# EAGLE design pedometer (EAGLE 9.6.2)
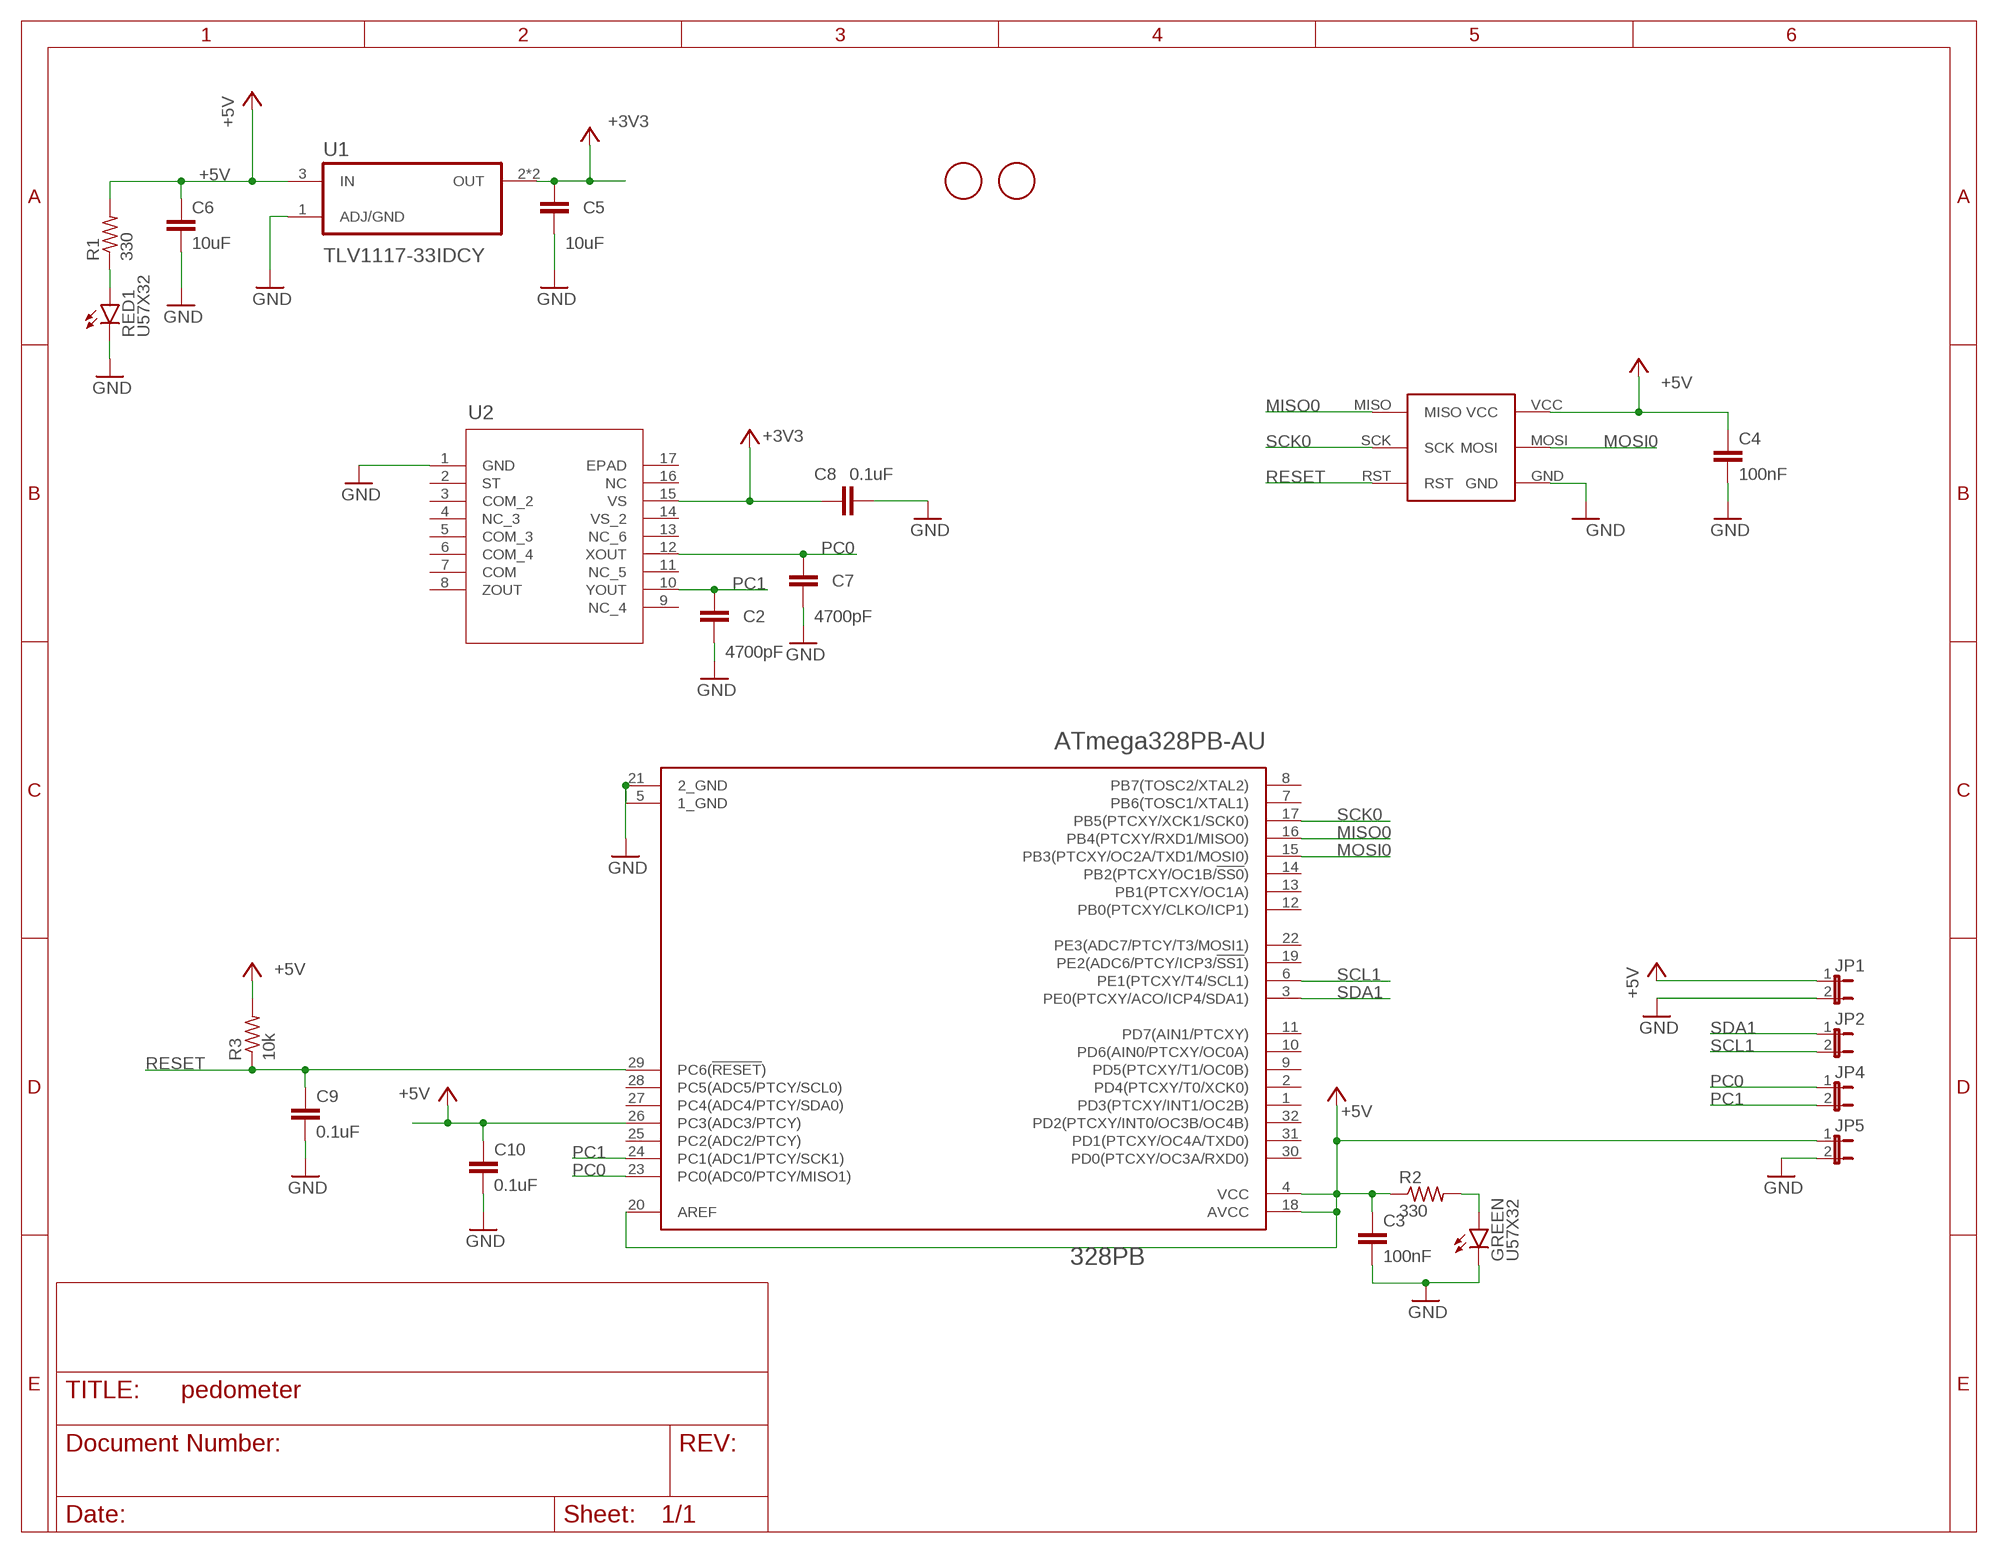
[diagram p0: schematic, sheet 1]

## Parts
328PB  MICROCHIP_ATMEGA328PB-AUMICROCHIP_ATMEGA328PB-AU_0_0  [MICROCHIP_ATMEGA328PB-AU_0]
C2  4700pF  C-EUC0805K  [C0805K]
C3  100nF  C-EUC0805K  [C0805K]
C4  100nF  C-EUC0805K  [C0805K]
C5  10uF  C-EUC0805K  [C0805K]
C6  10uF  C-EUC0805K  [C0805K]
C7  4700pF  C-EUC0805K  [C0805K]
C8  0.1uF  C-EUC0805K  [C0805K]
C9  0.1uF  C-EUC0805K  [C0805K]
C10  0.1uF  C-EUC0805K  [C0805K]
GREEN  U57X32  [U57X32]
JP1  JP1E  [JP1]
JP2  JP1E  [JP1]
JP4  JP1E  [JP1]
JP5  JP1E  [JP1]
R1  330  R-US_R0805  [R0805]
R2  330  R-US_R0805  [R0805]
R3  10k  R-US_R0805  [R0805]
RED1  U57X32  [U57X32]
U1  TLV1117-33IDCY  [SOT230P700X180-4N]
U2  ADXL327BCPZ-RL7CP_16_5A_ADI-M  [CP_16_5A_ADI-M]
U$1  AVR-ISP  [AVR-ISP]
U$2  FIDUCIAL  [FIDUCIAL_1MM]
U$3  FIDUCIAL  [FIDUCIAL_1MM]

## Nets
+3V3: C5.2 C8.2 U1.2(OUT) U1.4(OUT) U2.15(VS)
+5V: 328PB.4(VCC) 328PB.18(AVCC) 328PB.20(AREF) 328PB.26(PC3(ADC3/PTCY)) C3.2 C4.2 C6.2 C10.2 JP1.1 JP5.1 R1.2 R2.1 R3.2 U1.3(IN) U$1.VCC
GND: 328PB.5(1_GND) 328PB.21(2_GND) C2.1 C3.1 C4.1 C5.1 C6.1 C7.1 C8.1 C9.1 C10.1 GREEN.K(C) JP1.2 JP5.2 RED1.K(C) U1.1(ADJ/GND) U2.1(GND) U$1.GND
MISO0: 328PB.16(PB4(PTCXY/RXD1/MISO0)) U$1.MISO
MOSI0: 328PB.15(PB3(PTCXY/OC2A/TXD1/MOSI0)) U$1.MOSI
N$2: GREEN.A R2.2
N$6: R1.1 RED1.A
PC0: 328PB.23(PC0(ADC0/PTCY/MISO1)) C7.2 JP4.1 U2.12(XOUT)
PC1: 328PB.24(PC1(ADC1/PTCY/SCK1)) C2.2 JP4.2 U2.10(YOUT)
RESET: 328PB.29(PC6(!RESET!)) C9.2 R3.1 U$1.RST
SCK0: 328PB.17(PB5(PTCXY/XCK1/SCK0)) U$1.SCK
SCL1: 328PB.6(PE1(PTCXY/T4/SCL1)) JP2.2
SDA1: 328PB.3(PE0(PTCXY/ACO/ICP4/SDA1)) JP2.1
Unconnected: 328PB.1(PD3(PTCXY/INT1/OC2B)) 328PB.2(PD4(PTCXY/T0/XCK0)) 328PB.7(PB6(TOSC1/XTAL1)) 328PB.8(PB7(TOSC2/XTAL2)) 328PB.9(PD5(PTCXY/T1/OC0B)) 328PB.10(PD6(AIN0/PTCXY/OC0A)) 328PB.11(PD7(AIN1/PTCXY)) 328PB.12(PB0(PTCXY/CLKO/ICP1)) 328PB.13(PB1(PTCXY/OC1A)) 328PB.14(PB2(PTCXY/OC1B/!SS0!)) 328PB.19(PE2(ADC6/PTCY/ICP3/!SS1!)) 328PB.22(PE3(ADC7/PTCY/T3/MOSI1)) 328PB.25(PC2(ADC2/PTCY)) 328PB.27(PC4(ADC4/PTCY/SDA0)) 328PB.28(PC5(ADC5/PTCY/SCL0)) 328PB.30(PD0(PTCXY/OC3A/RXD0)) 328PB.31(PD1(PTCXY/OC4A/TXD0)) 328PB.32(PD2(PTCXY/INT0/OC3B/OC4B)) U2.2(ST) U2.3(COM_2) U2.4(NC_3) U2.5(COM_3) U2.6(COM_4) U2.7(COM) U2.8(ZOUT) U2.9(NC_4) U2.11(NC_5) U2.13(NC_6) U2.14(VS_2) U2.16(NC) U2.17(EPAD)

## Library data of the parts
328PB = Microchip - ATmega328PB-AU:MICROCHIP_ATMEGA328PB-AU: ATmega328PB Summary Datasheet; CENTROID_NOT_SPECIFIED: No; DATASHEET: http://ww1.microchip.com/downloads/en/DeviceDoc/40001907A.pdf; DIGIKEY_DESCRIPTION: IC MCU 8BIT 32KB FLASH 32TQFP; DIGIKEY_PART_NUMBER: ATMEGA328PB-AU-ND; LEAD_FREE: yes; MF: Microchip; MFG_PACKAGE_IDENT: 32A; MOUSER_PART_NUMBER: 556-ATMEGA328PB-AU; MPN: ATmega328PB-AU; PACKAGE: TQFP32; PREFIX: U; ROHS: yes; TEMPERATURE_RANGE_HIGH: +85°C; TEMPERATURE_RANGE_LOW: -40°C; VOLTAGE: 5.5V
C2-C10 = rcl:C-EU: CAPACITOR, European symbol; SPICEPREFIX: C
GREEN RED1 = led:U57X32: LED rectangle, 5.7 x 3.2 mm
JP1 JP2 JP4 JP5 = jumper:JP1E: JUMPER
R1-R3 = rcl:R-US_: RESISTOR, American symbol; SPICEPREFIX: R
U1 = TLV1117-33IDCY:TLV1117-33IDCY: Check prices <https://pricing.snapeda.com/parts/TLV1117-33IDCY/Texas%20Instruments/view-part?ref=eda>; AVAILABILITY: Good; DESCRIPTION: 800-mA, 15-V, linear voltage regulator 4-SOT-223 -40 to 125; MF: Texas Instruments; MP: TLV1117-33IDCY; PACKAGE: SOT-223-4 Texas Instruments; PRICE: None; PURCHASE-URL: https://pricing.snapeda.com/search/part/TLV1117-33IDCY/?ref=eda
U2 = adxl327:ADXL327BCPZ-RL7; BUILT_BY: EMA_UL_Team; COPYRIGHT: Copyright (C) 2018 Accelerated Designs. All rights reserved; MANUFACTURER_PART_NUMBER: ADXL327BCPZ-RL7; SOURCELIBRARY: Analog_2019-03-08; VENDOR: Analog Devices Inc
U$1 = AVR-ISP:AVR-ISP: Check prices <https://pricing.snapeda.com/parts/AVR-ISP/Gravitech/view-part?ref=eda>; AVAILABILITY: Bad; DESCRIPTION: Emulators / Simulators AVR USB IN CIRCUIT EMUL/PRGMR ISP; MF: Gravitech; MP: AVR-ISP; PACKAGE: None; PRICE: None
U$2 U$3 = adafruit:FIDUCIAL: For use by pick and place machines to calibrate the vision/machine, 1mm By microbuilder.eu

## Board
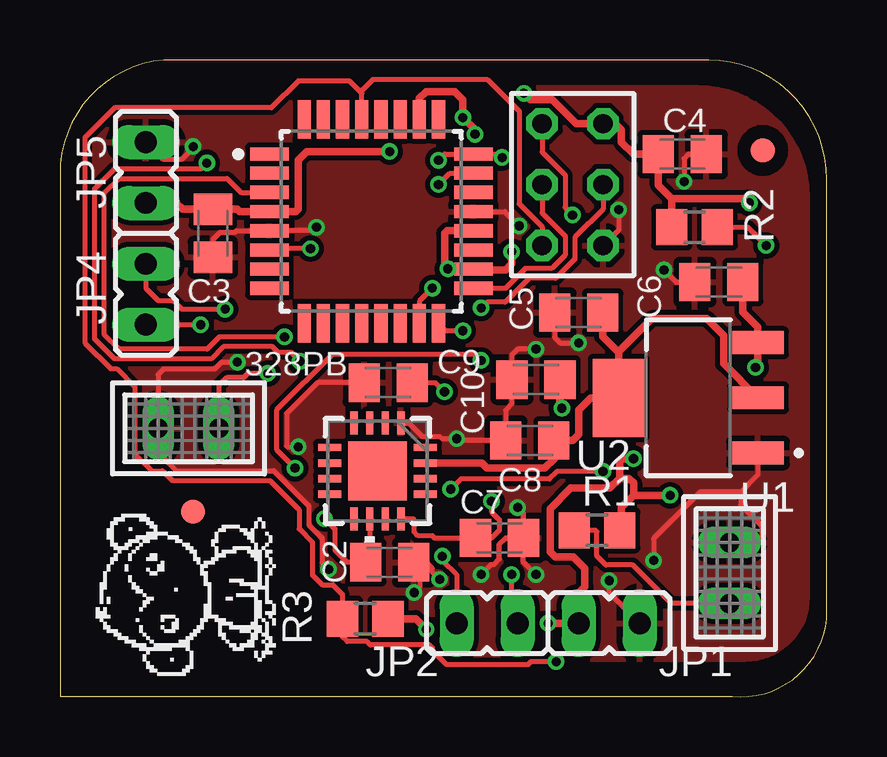
[diagram p1: board, top side]
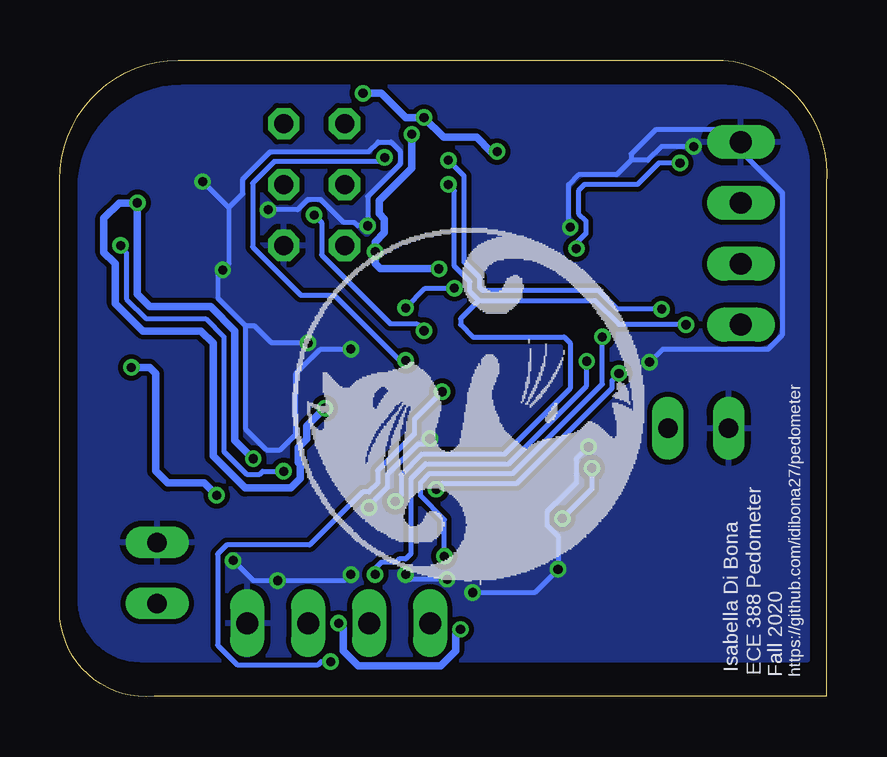
[diagram p2: board, bottom side, seen from below]

Size 31.95 x 26.55 mm. Coordinates in mm from the lower left corner, seen from the top.
Outline: 0.02,0.02 28.02,0.02 arc90 31.95,3.25 31.95,21.56 arc90 27.03,26.55 4.31,26.55 arc90 0.02,21.37 0.02,0.02
Copper layers (1*16): Top 0.035mm / dielectric 1.5mm / Bottom 0.035mm
Design rules "Dirty8TS": minimum track width 8mil, minimum drill 15mil, track to track 8mil, track to pad 8mil, pad to pad 8mil, via to via 8mil, smd to smd 0mil, copper to edge 10mil, drill to drill 10mil, minimum pad ring 10mil, minimum via ring 6mil, stop-mask expansion 2mil, vias tented up to drill 25mil, thermal gap 10mil

### Footprints (pad centres in the part's own frame; a part is rotated, then mirrored left to right if it is on the bottom)
MICROCHIP_ATMEGA328PB-AU_0 = smd 1.6 x 0.55: 1 -4.25,2.8; 2 -4.25,2; 3 -4.25,1.2; 4 -4.25,0.4; 5 -4.25,-0.4; 6 -4.25,-1.2; 7 -4.25,-2; 8 -4.25,-2.8; 17 4.25,-2.8; 18 4.25,-2; 19 4.25,-1.2; 20 4.25,-0.4; 21 4.25,0.4; 22 4.25,1.2; 23 4.25,2; 24 4.25,2.8 | smd 0.55 x 1.6: 9 -2.8,-4.25; 10 -2,-4.25; 11 -1.2,-4.25; 12 -0.4,-4.25; 13 0.4,-4.25; 14 1.2,-4.25; 15 2,-4.25; 16 2.8,-4.25; 25 2.8,4.25; 26 2,4.25; 27 1.2,4.25; 28 0.4,4.25; 29 -0.4,4.25; 30 -1.2,4.25; 31 -2,4.25; 32 -2.8,4.25
C0805K = smd 1.3 x 1.6: 1 -1,0; 2 1,0
U57X32 = drill 0.813 long: A -1.27,0; K 1.27,0
JP1 = drill 0.914 long: 1 0,-1.27; 2 0,1.27
R0805 = smd 1.3 x 1.5: 1 -0.95,0; 2 0.95,0
SOT230P700X180-4N = smd 2.15 x 0.95: 1 -2.9,2.3; 2 -2.9,0; 3 -2.9,-2.3 | smd 2.15 x 3.25: 4 2.9,0
CP_16_5A_ADI-M = smd 0.965 x 0.305: 1 -1.994,0.975; 2 -1.994,0.325; 3 -1.994,-0.325; 4 -1.994,-0.975; 9 1.994,-0.975; 10 1.994,-0.325; 11 1.994,0.325; 12 1.994,0.975 | smd 0.305 x 0.965: 5 -0.975,-1.994; 6 -0.325,-1.994; 7 0.325,-1.994; 8 0.975,-1.994; 13 0.975,1.994; 14 0.325,1.994; 15 -0.325,1.994; 16 -0.975,1.994 | smd 2.438 x 2.438: 17 0,0
AVR-ISP = drill 0.8 octagon: GND 2.54,1.27; MISO -2.54,-1.27; MOSI 0,1.27; RST 2.54,-1.27; SCK 0,-1.27; VCC -2.54,1.27
FIDUCIAL_1MM = smd 1 x 1: 1 0,0

### Placement (x,y rotation side)
328PB  12.97,19.83 0 top
C2  13.74,5.6 180 top
C3  6.37,19.32 90 top
C4  25.93,22.62 180 top
C5  21.61,16.02 0 top
C6  27.45,17.29 0 top
C7  18.31,6.62 180 top
C8  19.58,10.68 0 top
C9  13.67,13.1 0 top
C10  19.83,13.22 0 top
GREEN  5.35,11.19 180 top
JP1  22.88,3.06 270 top
JP2  17.8,3.06 270 top
JP4  3.58,16.78 0 top
JP5  3.58,21.86 0 top
R1  22.37,6.94 0 top
R2  26.44,19.57 0 top
R3  12.72,3.26 0 top
RED1  27.9,5.16 90 top
U1  26.18,12.46 180 top
U2  13.23,9.41 270 top
U$1  21.36,21.35 270 top
U$2  29.28,22.78 0 top
U$3  5.54,7.71 0 top

### Tracks (layer width: path | path; a pad name or v marks a point on that pad's centre or on a via)
+3V3
  Top 0.305: 23.28,14.35 U1.4 22.12,12.46 21.61,11.95 21.61,10.94 21.36,10.68 C8.2 20.59,10.67 20.59,9.92 20.2,9.53 17.78,9.53 17.57,9.74 U2.15 | C5.2 22.61,15.02 23.28,14.35 | U1.2 27.65,13.89 27.65,15.06 26.94,15.76 24.66,15.76 23.28,14.39 23.28,14.35
+5V  (via drill 0.38)
  Top 0.305: R2.1 25.49,20.78 | 25.49,20.78 24.93,21.34 C4.2 23.9,22.62 23.39,23.13 23.39,23.64 23.13,23.89 U$1.VCC 21.51,23.89 20.5,24.9 19.58,24.9 v19.32,25.16 | v23.9,9.92 23.39,9.92 23.33,9.86 23.33,9.11 | v28.72,20.59 28.53,20.78 25.49,20.78 | v13.74,22.73 10.29,22.73 9.93,22.37 9.93,20.34 9.82,20.23 328PB.4 7.49,20.23 7.39,20.34 6.39,20.34 C3.2 5.12,20.32 4.85,20.59 JP5.1 | v17.29,23.45 17.29,23.64 v16.78,24.15 16.78,24.9 16.45,25.23 15.26,25.23 14.97,24.95 328PB.26 | v18.82,18.56 18.82,18.05 18.56,17.8 17.26,17.8 328PB.18 | 23.33,9.11 22.92,8.7 21.28,8.7 20.42,7.84 20.42,6.04 20.63,5.83 21.38,5.83 21.86,5.35 21.86,4.59 21.61,4.33 JP1.1 v20.34,3.06 | C10.2 20.83,12.11 v20.91,12.03 | C6.2 28.45,16.03 29.08,15.4 U1.3 29.08,13.84 v28.98,13.73 | R1.2 23.39,7 23.39,7.89 23.9,8.4 | 23.9,8.4 v25.42,8.4 | 23.33,9.11 23.69,9.11 23.9,8.91 23.9,8.4 | R3.2 14.82,3.26 v15.26,2.81 | 328PB.20 16.13,19.43 16.02,19.32 16.02,17.98 v16.16,17.84
  Bottom 0.305: v23.9,9.92 24.66,10.68 24.66,15.26 25.67,16.27 28.21,16.27 28.72,16.78 v28.72,20.59 29.48,20.59 30.12,19.96 30.12,18.52 29.71,18.11 29.7,18.11 29.64,18.05 29.64,16.4 28.49,15.26 26.08,15.26 25.57,14.75 25.57,10.04 24.24,8.7 22.34,8.7 21.93,9.11 21.93,9.69 22.01,9.77 22.01,10.4 21.66,10.75 21.66,11.28 v20.91,12.03 | v13.74,22.73 14,22.73 14.59,23.32 15.96,23.32 v16.78,24.15 17.55,24.15 18.56,25.16 v19.32,25.16 | v17.29,23.45 17.29,22.05 18.65,20.68 18.65,20.15 18.43,19.92 18.43,19.34 18.82,18.96 v18.82,18.56 18.82,18.05 18.61,17.84 v16.16,17.84 | v28.98,13.73 28.21,13.73 27.96,13.48 27.96,9.41 27.45,8.91 25.93,8.91 v25.42,8.4 | v20.34,3.06 20.14,2.86 20.14,1.91 19.51,1.29 16.09,1.29 15.46,1.91 15.46,2.61 v15.26,2.81
GND  (via drill 0.38)
  Top 0.203: JP1.2 22.88,4.33 v22.88,4.84 | v19.83,5.1 19.31,5.62 C7.1 | v17.55,5.1 17.97,5.52 18.08,5.52 18.31,5.74 18.31,6.37 18.56,6.62 C7.1 | v7.39,13.95 6.73,13.95 6.47,13.68 4.34,13.68 4.08,13.43 GREEN.K 4.08,10.18 4.85,9.41 8.91,9.41 10.37,7.95 10.37,7.16 10.92,6.61 10.92,5.59 v11.2,5.31 | v10.69,19.57 10.54,19.43 328PB.5 7.36,19.43 7.3,19.37 6.67,19.37 6.37,19.07 C3.1 | JP5.2 4.29,22.42 5.1,22.42 5.55,22.86 v5.55,22.94 | v25.17,17.8 25.67,17.29 C6.1 | C4.1 26.18,22.62 26.01,22.45 v26.01,21.48 | 328PB.21 18.54,20.23 v19.13,19.63 | v23.27,20.3 23.27,19.46 U$1.GND | C5.1 20.61,14.99 20.85,14.75 v21.61,14.75 | U2.1 14.54,11.41 15.1,10.85 15.83,10.85 15.92,10.76 v16.53,10.76 16.61,10.68 18.56,10.68 | v19.07,7.89 19.31,7.65 C7.1 | C8.1 18.56,10.68 | v15.82,4.89 15.51,5.2 15.51,5.35 15.26,5.6 14.75,5.6 | 14.75,5.6 C2.1 | v19.83,14.49 19.07,14.49 18.83,14.26 C10.1 18.83,12.22 18.56,11.95 18.56,10.68 | v14.76,4.34 15.01,4.59 15.01,5.35 14.75,5.6 | C9.1 10.73,13.1 9.44,11.81 9.44,10.45 9.48,10.42 v9.93,10.42 | U1.1 29.08,9.27 28.35,8.54 | 28.35,8.54 26.68,8.54 24.74,6.6 v24.74,5.68 | 28.35,8.54 28.35,8 29.23,7.13 29.23,6.62 29.04,6.43 RED1.K
  Bottom 0.203: v19.83,5.1 20.09,4.84 v22.88,4.84 23.9,4.84 v24.74,5.68 | v15.82,4.89 17.34,4.89 v17.55,5.1 | v7.39,13.95 6.84,14.49 2.44,14.49 1.85,15.09 1.85,21.01 4.48,23.64 7.13,23.64 8.15,22.62 8.15,22.37 | v10.69,19.57 10.76,19.64 10.76,21.35 10.35,21.76 8.76,21.76 8.15,22.37 | v5.55,22.94 6.88,22.94 7.45,22.37 8.15,22.37 | v26.01,21.48 24.91,20.38 | 24.91,20.38 24.91,18.05 v25.17,17.8 25.35,17.61 25.35,16.6 24.2,15.45 | v23.27,20.3 22.05,20.3 21.62,20.73 21.09,20.73 20.13,19.77 19.69,19.77 19.55,19.63 v19.13,19.63 19.13,20.85 17.77,22.21 17.77,22.75 18.15,23.13 18.69,23.13 19.1,22.72 23.19,22.72 24.33,21.58 24.33,20.97 24.91,20.38 | 24.2,15.45 24.2,11.14 23.35,10.29 22.77,10.29 22.12,10.94 22.12,13.48 21.1,14.49 v19.83,14.49 | v21.61,14.75 23.13,14.75 23.83,15.45 24.2,15.45 | v16.53,10.76 16.77,10.52 17.05,10.52 18.31,9.26 18.31,8.73 19.07,7.97 v19.07,7.89 | v14.76,4.34 12.17,4.34 v11.2,5.31 11.2,6.69 11.67,7.16 11.67,7.7 11.29,8.08 11.26,8.08 10.43,8.91 10.43,9.26 10.44,9.26 10.44,9.91 v9.93,10.42
  pour Top: 4.08,25.42 26.57,25.42 arc-90 31.14,20.85 31.14,4.14 arc-90 28.53,1.54 0.85,1.54 0.85,22.18 arc-90
  pour Bottom: 0.78,1.54 0.78,22 arc-90 4.2,25.42 26.86,25.42 arc-90 31.14,21.14 31.14,4.08 arc-90 28.6,1.54
MISO0  (via drill 0.38)
  Top 0.203: U$1.MISO 20.09,22.71 21.05,21.75 21.05,20.39 v21.36,20.08 | v16.78,15.26 16.1,15.26 328PB.16
  Bottom 0.203: v21.36,20.08 21.05,19.77 21.05,18.42 18.19,15.56 17.09,15.56 v16.78,15.26
MOSI0  (via drill 0.38)
  Top 0.203: v17.55,16.21 17.79,16.45 18.55,16.45 19.55,17.45 20.65,17.45 21.45,18.25 21.45,19.16 22.63,20.34 U$1.MOSI | 328PB.15 14.97,16.49 v15.51,17.03
  Bottom 0.203: v17.55,16.21 16.72,17.03 v15.51,17.03
N$2  (via drill 0.38)
  Top 0.203: R2.2 28.66,19.57 v29.42,18.81 | v22.63,9.4 20.72,9.4 20.39,9.07 16.7,9.07 v16.28,8.65 | v8.66,13.48 7.83,13.48 7.65,13.3 6.95,13.3 6.62,12.97 GREEN.A
  Bottom 0.203: v29.42,18.81 29.42,18.75 29.18,18.51 29.18,16.59 28.35,15.76 25.88,15.76 25.12,15 25.12,10.23 24.16,9.27 23.63,9.27 23.5,9.4 v22.63,9.4 | v16.28,8.65 16.04,8.89 12.92,8.89 8.95,12.87 8.95,13.19 v8.66,13.48
N$6
  Top 0.203: RED1.A 25.47,3.89 23.87,5.49 22.74,5.49 22.37,5.86 22.37,6.87 22.3,6.94 R1.1
PC0  (via drill 0.38)
  Top 0.203: JP4.1 v5.86,15.51 | v15.77,21.35 16.24,21.83 328PB.23 | v17.98,8.14 17.98,7.71 18.31,7.38 18.31,6.94 17.99,6.62 C7.2 15.6,6.62 15.51,6.71 14.91,6.71 14.75,6.87 14.75,7.38 14.71,7.42 U2.12
  Bottom 0.203: v5.86,15.51 8.66,15.51 9.67,16.53 14.5,16.53 | 14.5,16.53 14.87,16.89 14.87,17.3 15.51,17.95 15.51,21.1 v15.77,21.35 | v17.98,8.14 17.74,8.39 17.74,9.26 16.88,10.11 13.43,10.11 10.69,12.85 10.69,14.75 10.94,15 14.75,15 15.26,15.51 15.26,15.76 14.5,16.53
PC1  (via drill 0.38)
  Top 0.203: JP4.2 3.58,17.03 4.08,16.53 4.71,16.53 5.08,16.16 v6.88,16.16 | v15.77,22.37 16.03,22.63 328PB.24 18.27,22.63 v18.42,22.48 | U2.10 12.9,6.55 12.72,6.37 12.72,5.62 | 12.72,5.62 C2.2 | v17.55,14.02 17.29,14.28 11.33,14.28 9.01,11.95 9.01,10.31 v9.79,9.53 | v11.02,7.43 11.45,7 11.45,6.11 11.94,5.62 12.72,5.62
  Bottom 0.203: v6.88,16.16 8.73,16.16 9.5,16.93 14.33,16.93 14.46,17.06 14.46,17.47 15.11,18.12 15.11,21.71 v15.77,22.37 | v18.42,22.48 18.59,22.31 23.02,22.31 23.92,21.41 23.92,18.75 21.91,16.74 20.52,16.74 17.8,14.02 v17.55,14.02 | v9.79,9.53 9.79,8.66 v11.02,7.43
RESET  (via drill 0.38)
  Top 0.203: 328PB.29 12.57,25.16 | 12.57,25.16 12.57,25.27 13.05,25.74 17.8,25.74 19.13,24.41 19.13,20.55 20.09,19.59 U$1.RST | 12.57,25.16 12.07,25.67 9.93,25.67 8.81,24.55 2.28,24.55 1.04,23.31 1.04,14.75 2.11,13.68 2.36,13.68 3.12,12.92 3.12,10.18 3.12,10.13 3.84,9.41 4.27,9.41 4.68,9.01 8.74,9.01 9.96,7.79 9.96,6.99 10.52,6.44 10.52,5.08 10.93,4.67 11.37,4.67 11.77,4.27 R3.1 11.77,2.49 11.96,2.3 12.79,2.3 12.93,2.16 15.4,2.16 15.51,2.05 15.51,1.93 16.11,1.34 19.49,1.34 19.61,1.46 v20.67,1.46 | C9.2 15.64,13.1 v16.02,12.72
  Bottom 0.203: v16.02,12.72 17.18,11.56 17.18,10.94 17.19,10.93 17.22,10.93 18.71,9.43 18.71,8.9 19.08,8.54 19.34,8.54 21.55,6.33 25,6.33 25.38,5.95 25.38,2.15 24.57,1.34 21.19,1.34 21.07,1.46 v20.67,1.46
SCK0
  Top 0.203: U$1.SCK 20.09,20.17 21.05,19.21 21.05,18.42 20.48,17.85 19.38,17.85 18.56,17.03 328PB.17
SCL1  (via drill 0.38)
  Top 0.203: JP2.2 19.07,4.08 18.82,4.33 v18.82,5.1 | v10,13.99 9.63,14.35 9.09,14.35 8.84,14.6 6.81,14.6 6.3,14.09 2.28,14.09 1.44,14.92 1.44,21.18 2.28,22.01 5.88,22.01 v6.12,22.25 | v10.43,18.69 8.78,18.69 328PB.6
  Bottom 0.203: v10,13.99 10,12.96 13.26,9.71 16.71,9.71 17.33,9.09 17.33,5.96 17.55,5.74 17.81,5.74 17.95,5.6 18.56,5.6 18.82,5.35 v18.82,5.1 | v6.12,22.25 6.99,22.25 7.89,21.35 10.09,21.35 10.35,21.1 10.35,20.15 10.04,19.84 10.04,19.31 10.43,18.91 v10.43,18.69
SDA1  (via drill 0.38)
  Top 0.203: 328PB.3 7.54,21.03 6.97,21.61 2.44,21.61 1.85,21.01 1.85,15.09 2.44,14.49 6.13,14.49 6.64,15 v9.35,15 | v15.93,5.86 15.93,5.69 16.53,5.1 JP2.1
  Bottom 0.203: v15.93,5.86 15.93,7.39 16.92,8.38 16.92,8.92 16.54,9.3 13.09,9.3 9.35,13.04 v9.35,15

### Text on the board
bPlace: https://github.com/idibona27/pedometer | Fall 2020 | ECE 388 Pedometer | Isabella Di Bona